# Altium schematic sheet Sheet1.SchDoc
size B
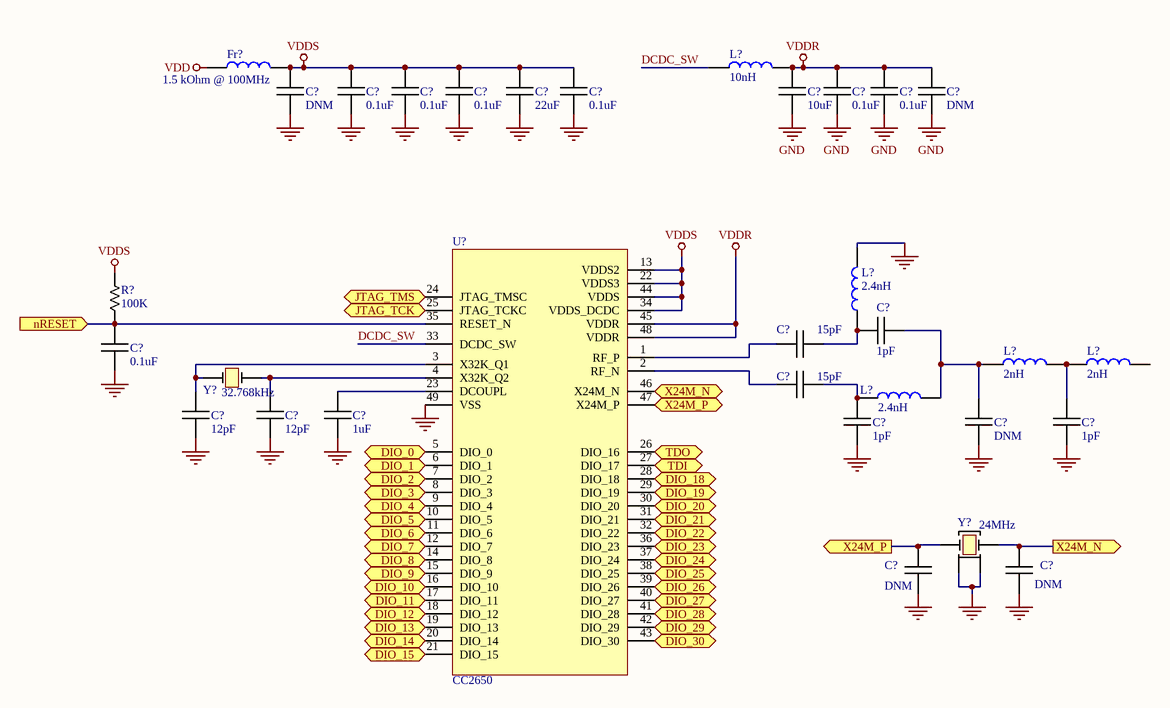
[diagram p0: Sheet1.SchDoc]

## Parts
(Parts that share a designator on the sheet are numbered #1, #2 ... from top to bottom, then left to right.)
C?#1  DNM
C?#2  0.1uF
C?#3  0.1uF
C?#4  0.1uF
C?#5  22uF
C?#6  0.1uF
C?#7  10uF
C?#8  0.1uF
C?#9  0.1uF
C?#10  DNM
C?#11  1pF
C?#12  0.1uF
C?#13  15pF
C?#14  15pF
C?#15  12pF
C?#16  12pF
C?#17  1uF
C?#18  1pF
C?#19  DNM
C?#20  1pF
C?#21  DNM
C?#22  DNM
Fr?  1.5 kOhm @ 100MHz
L?#1  10nH
L?#2  2.4nH
L?#3  2nH
L?#4  2nH
L?#5  2.4nH
R?  100K  [R0603]
U?  CC2650
Y?#1  32.768kHz
Y?#2  24MHz

## Ports
DIO_0 (bidir), DIO_1 (bidir), DIO_2 (bidir), DIO_3 (bidir), DIO_4 (bidir), DIO_5 (bidir), DIO_6 (bidir), DIO_7 (bidir), DIO_8 (bidir), DIO_9 (bidir), DIO_10 (bidir), DIO_11 (bidir), DIO_12 (bidir), DIO_13 (bidir), DIO_14 (bidir), DIO_15 (bidir), DIO_18 (bidir), DIO_19 (bidir), DIO_20 (bidir), DIO_21 (bidir), DIO_22 (bidir), DIO_23 (bidir), DIO_24 (bidir), DIO_25 (bidir), DIO_26 (bidir), DIO_27 (bidir), DIO_28 (bidir), DIO_29 (bidir), DIO_30 (bidir), JTAG_TCK (in), JTAG_TMS (in), nRESET (in), TDI (bidir), TDO (bidir), X24M_N (in), X24M_N (out), X24M_P (in), X24M_P (out)

## Nets
GND: C?#1.1 C?#2.1 C?#3.1 C?#4.1 C?#5.1 C?#6.1 C?#7.1 C?#8.1 C?#9.1 C?#10.1 C?#12.1 C?#15.1 C?#16.1 C?#17.1 C?#18.1 C?#19.1 C?#20.1 C?#21.1 C?#22.1 L?#2.2 U?.49(VSS) Y?#2.2 Y?#2.4
VDD: Fr?.1
VDDR: C?#7.2 C?#8.2 C?#9.2 C?#10.2 L?#1.2 U?.45(VDDR) U?.48(VDDR)
VDDS: C?#1.2 C?#2.2 C?#3.2 C?#4.2 C?#5.2 C?#6.2 Fr?.2 R?.2 U?.13(VDDS2) U?.22(VDDS3) U?.34(VDDS_DCDC) U?.44(VDDS)
DCDC_SW: L?#1.1 U?.33(DCDC_SW)
DIO_0: U?.5(DIO_0) ; port DIO_0
DIO_1: U?.6(DIO_1) ; port DIO_1
DIO_2: U?.7(DIO_2) ; port DIO_2
DIO_3: U?.8(DIO_3) ; port DIO_3
DIO_4: U?.9(DIO_4) ; port DIO_4
DIO_5: U?.10(DIO_5) ; port DIO_5
DIO_6: U?.11(DIO_6) ; port DIO_6
DIO_7: U?.12(DIO_7) ; port DIO_7
DIO_8: U?.14(DIO_8) ; port DIO_8
DIO_9: U?.15(DIO_9) ; port DIO_9
DIO_10: U?.16(DIO_10) ; port DIO_10
DIO_11: U?.17(DIO_11) ; port DIO_11
DIO_12: U?.18(DIO_12) ; port DIO_12
DIO_13: U?.19(DIO_13) ; port DIO_13
DIO_14: U?.20(DIO_14) ; port DIO_14
DIO_15: U?.21(DIO_15) ; port DIO_15
DIO_18: U?.28(DIO_18) ; port DIO_18
DIO_19: U?.29(DIO_19) ; port DIO_19
DIO_20: U?.30(DIO_20) ; port DIO_20
DIO_21: U?.31(DIO_21) ; port DIO_21
DIO_22: U?.32(DIO_22) ; port DIO_22
DIO_23: U?.36(DIO_23) ; port DIO_23
DIO_24: U?.37(DIO_24) ; port DIO_24
DIO_25: U?.38(DIO_25) ; port DIO_25
DIO_26: U?.39(DIO_26) ; port DIO_26
DIO_27: U?.40(DIO_27) ; port DIO_27
DIO_28: U?.41(DIO_28) ; port DIO_28
DIO_29: U?.42(DIO_29) ; port DIO_29
DIO_30: U?.43(DIO_30) ; port DIO_30
JTAG_TCK: U?.25(JTAG_TCKC) ; port JTAG_TCK
JTAG_TMS: U?.24(JTAG_TMSC) ; port JTAG_TMS
nRESET: C?#12.2 R?.1 U?.35(RESET_N) ; port nRESET
TDI: U?.27(DIO_17) ; port TDI
TDO: U?.26(DIO_16) ; port TDO
X24M_N: C?#22.2 U?.46(X24M_N) Y?#2.3 ; port X24M_N
X24M_P: C?#21.2 U?.47(X24M_P) Y?#2.1 ; port X24M_P
NetC?#11_1: C?#11.1 C?#13.2 L?#2.1
NetC?#11_2: C?#11.2 C?#19.2 L?#3.1 L?#5.2
NetC?#13_1: C?#13.1 U?.1(RF_P)
NetC?#14_1: C?#14.1 U?.2(RF_N)
NetC?#14_2: C?#14.2 C?#18.2 L?#5.1
NetC?#15_2: C?#15.2 U?.3(X32K_Q1) Y?#1.1
NetC?#16_2: C?#16.2 U?.4(X32K_Q2) Y?#1.2
NetC?#17_2: C?#17.2 U?.23(DCOUPL)
NetC?#20_2: C?#20.2 L?#3.2 L?#4.1

Not connected (* = marked no-connect by the designer): L?#4 2

## Library data of the parts
C?#1 C?#10 C?#19 C?#21 C?#22 = DNM: SMD_CAPACITOR; Packet: 0402; Capacitance: DNM
C?#2-C?#4 C?#6 C?#8 C?#9 C?#12 = C0.1uF_0402: SMD_CAPACITOR; Voltage - Rated: 6.3V; Tolerance: ±10%; Packet: 0402; Digi-Key Part Number: 490-6319-1-ND; Capacitance: 0.1uF
C?#5 = C22uF_0603: SMD_CAPACITOR; Voltage - Rated: 4V; Tolerance: ±20%; Packet: 0603; Digi-Key Part Number: 490-5526-1-ND; Capacitance: 22uF
C?#7 = C10uF_0603: SMD_CAPACITOR; Voltage - Rated: 6.3V; Tolerance: ±20%; Packet: 0603; Digi-Key Part Number: 490-3896-1-ND; Capacitance: 10uF
C?#11 C?#18 C?#20 = C1pF_0402: SMD_CAPACITOR; Voltage - Rated: 50V; Tolerance: ±0.25pF; Packet: 0402; Digi-Key Part Number: 490-3199-1-ND; Capacitance: 1pF
C?#13 C?#14 = C15pF_0603: SMD_CAPACITOR; Voltage - Rated: 50V; Tolerance: ±5%; Packet: 0402; Digi-Key Part Number: 712-1261-1-ND; Capacitance: 15pF
C?#15 C?#16 = C12pF_0402: SMD_CAPACITOR; Voltage - Rated: 50V; Tolerance: ±5%; Packet: 0402; Digi-Key Part Number: 490-5924-1-ND; Capacitance: 12pF
C?#17 = C1uF_0402: SMD_CAPACITOR; Voltage - Rated: 10V; Tolerance: ±10%; Packet: 0402; Digi-Key Part Number: 490-3890-1-ND; Capacitance: 1uF
Fr? = Fr1.5 kOhm: SMD_Ferrite Beads; Digi-Key Part Number: 490-5216-1-ND; Inductance: 1.5 kOhm @ 100MHz; Package: 0603
L?#1 = L10nH_0805: SMD_Inductor; Digi-Key Part Number: 587-2608-1-ND; Inductance: 10nH; Package: 0805
L?#2 L?#5 = L2.4nH_0402: SMD_Inductor; Digi-Key Part Number: 490-8389-1-ND; Inductance: 2.4nH; Package: 0402
L?#3 L?#4 = L2nH_0402: SMD_Inductor; Digi-Key Part Number: 490-6569-1-ND; Inductance: 2nH; Package: 0402
R? = R100K_0402: SMD_RESISTOR; Packet: 0402; Tolerance: ±5%; Power: 1/16W; Digi-Key Part Number: 541-2190-1-ND; Value: 100K
U? = CC2650F128RGZR: IC RF TXRX+MCU 802.15.4/BT 48QFN; Packet: 48-VFQFN Exposed Pad; Digi-Key Part Number: 296-44316-1-ND
Y?#1 = 32.7680KHz_SMD: Crystal; Load Capacitance: 12.5pF; Frequency: 32.768kHz; Digi-Key Part Number: SER4077CT-ND
Y?#2 = 24MHz_SMD: Crystal; Load Capacitance: 9pF; Frequency: 24MHz; Digi-Key Part Number: SER3635CT-ND